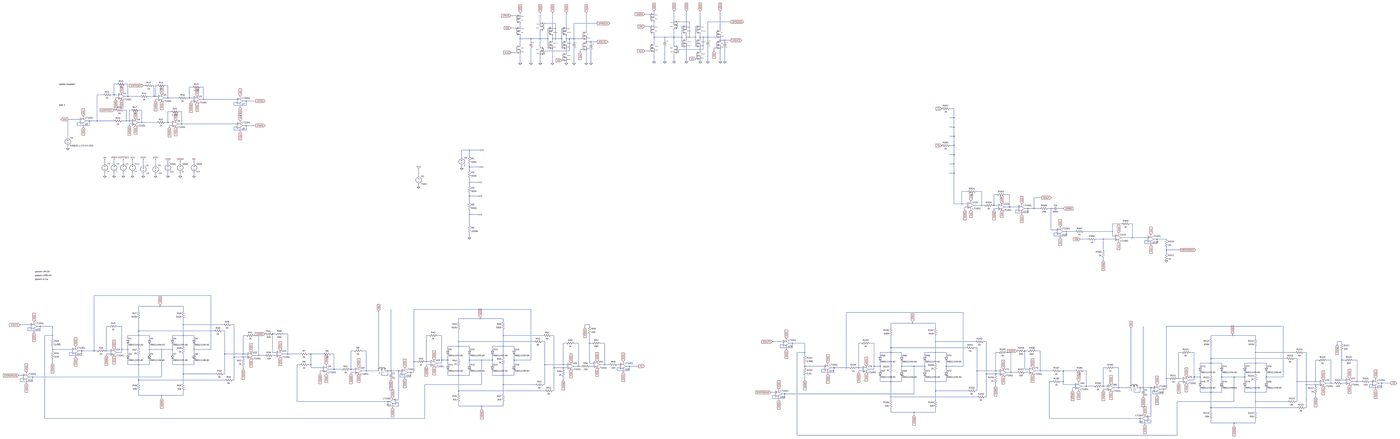
[diagram p0: schematic OZ_2_pure_curves.asc, whole sheet]
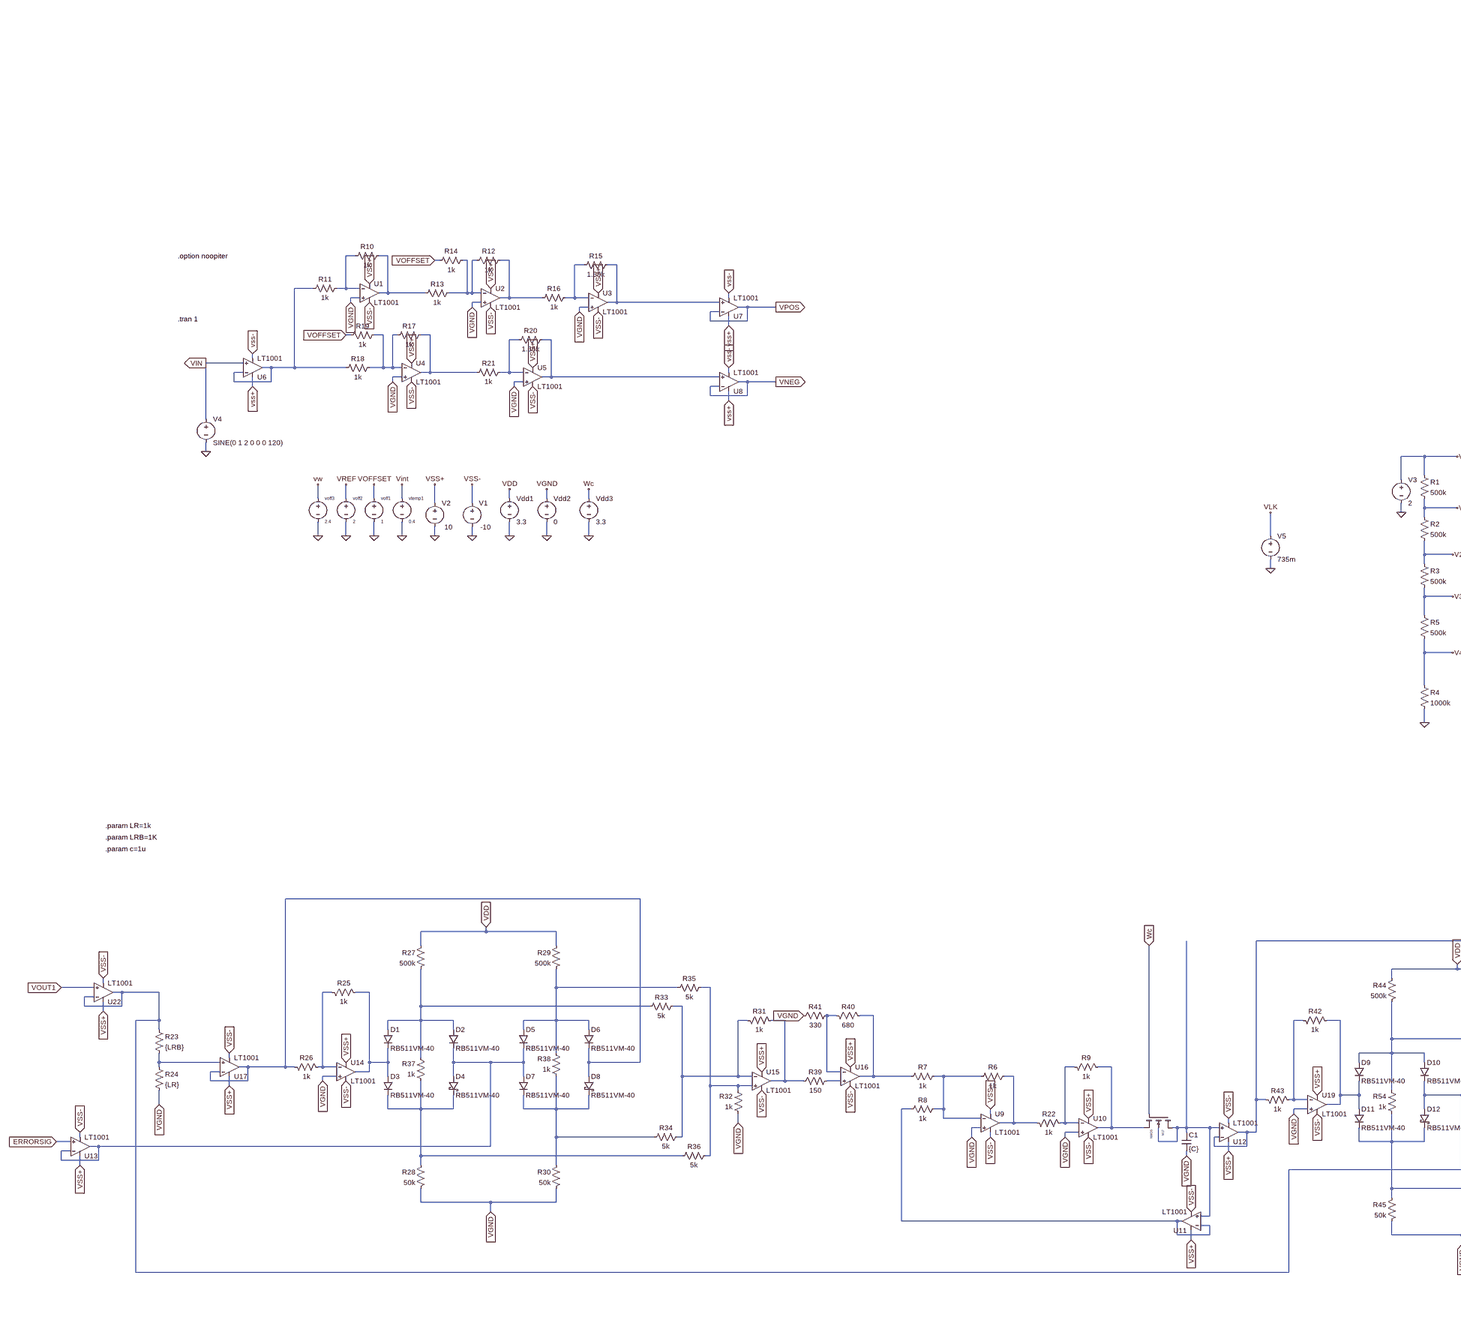
[diagram p1: schematic OZ_2_pure_curves.asc, part, row 1 of 1, column 1 of 3]
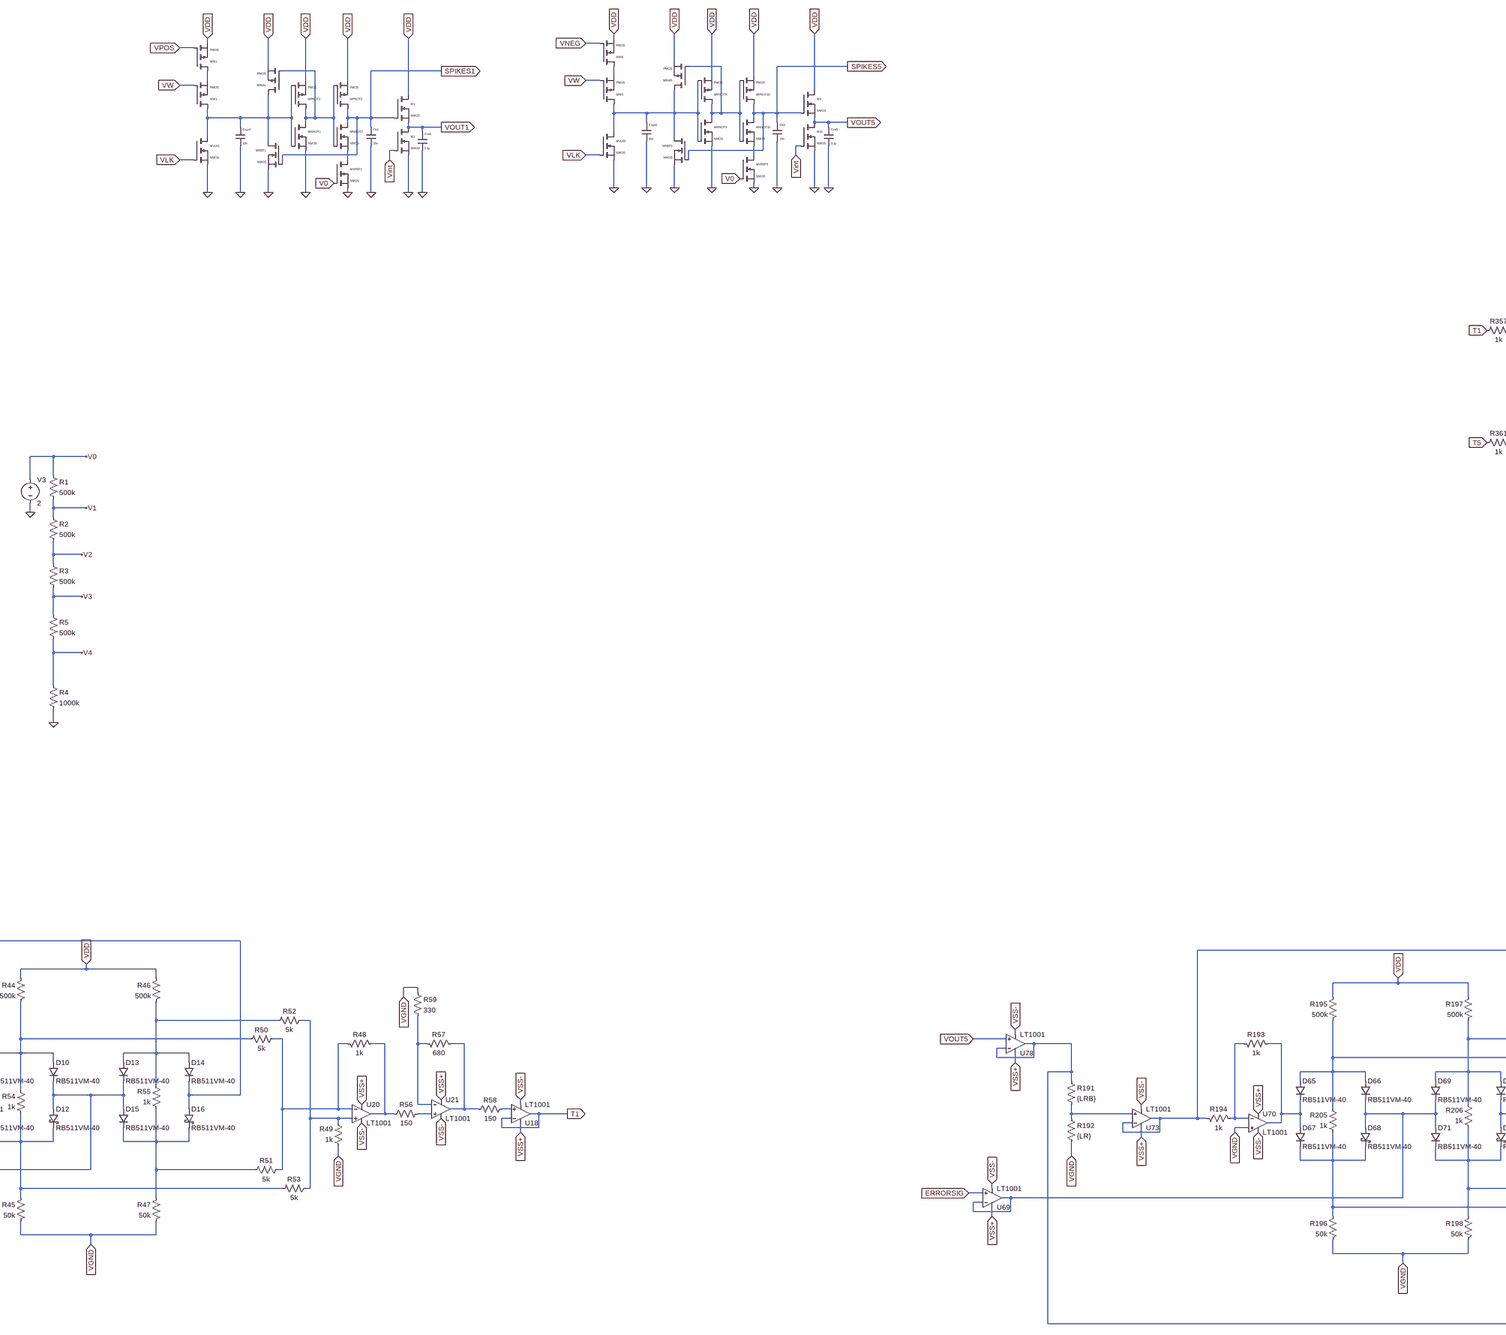
[diagram p2: schematic OZ_2_pure_curves.asc, part, row 1 of 1, column 2 of 3]
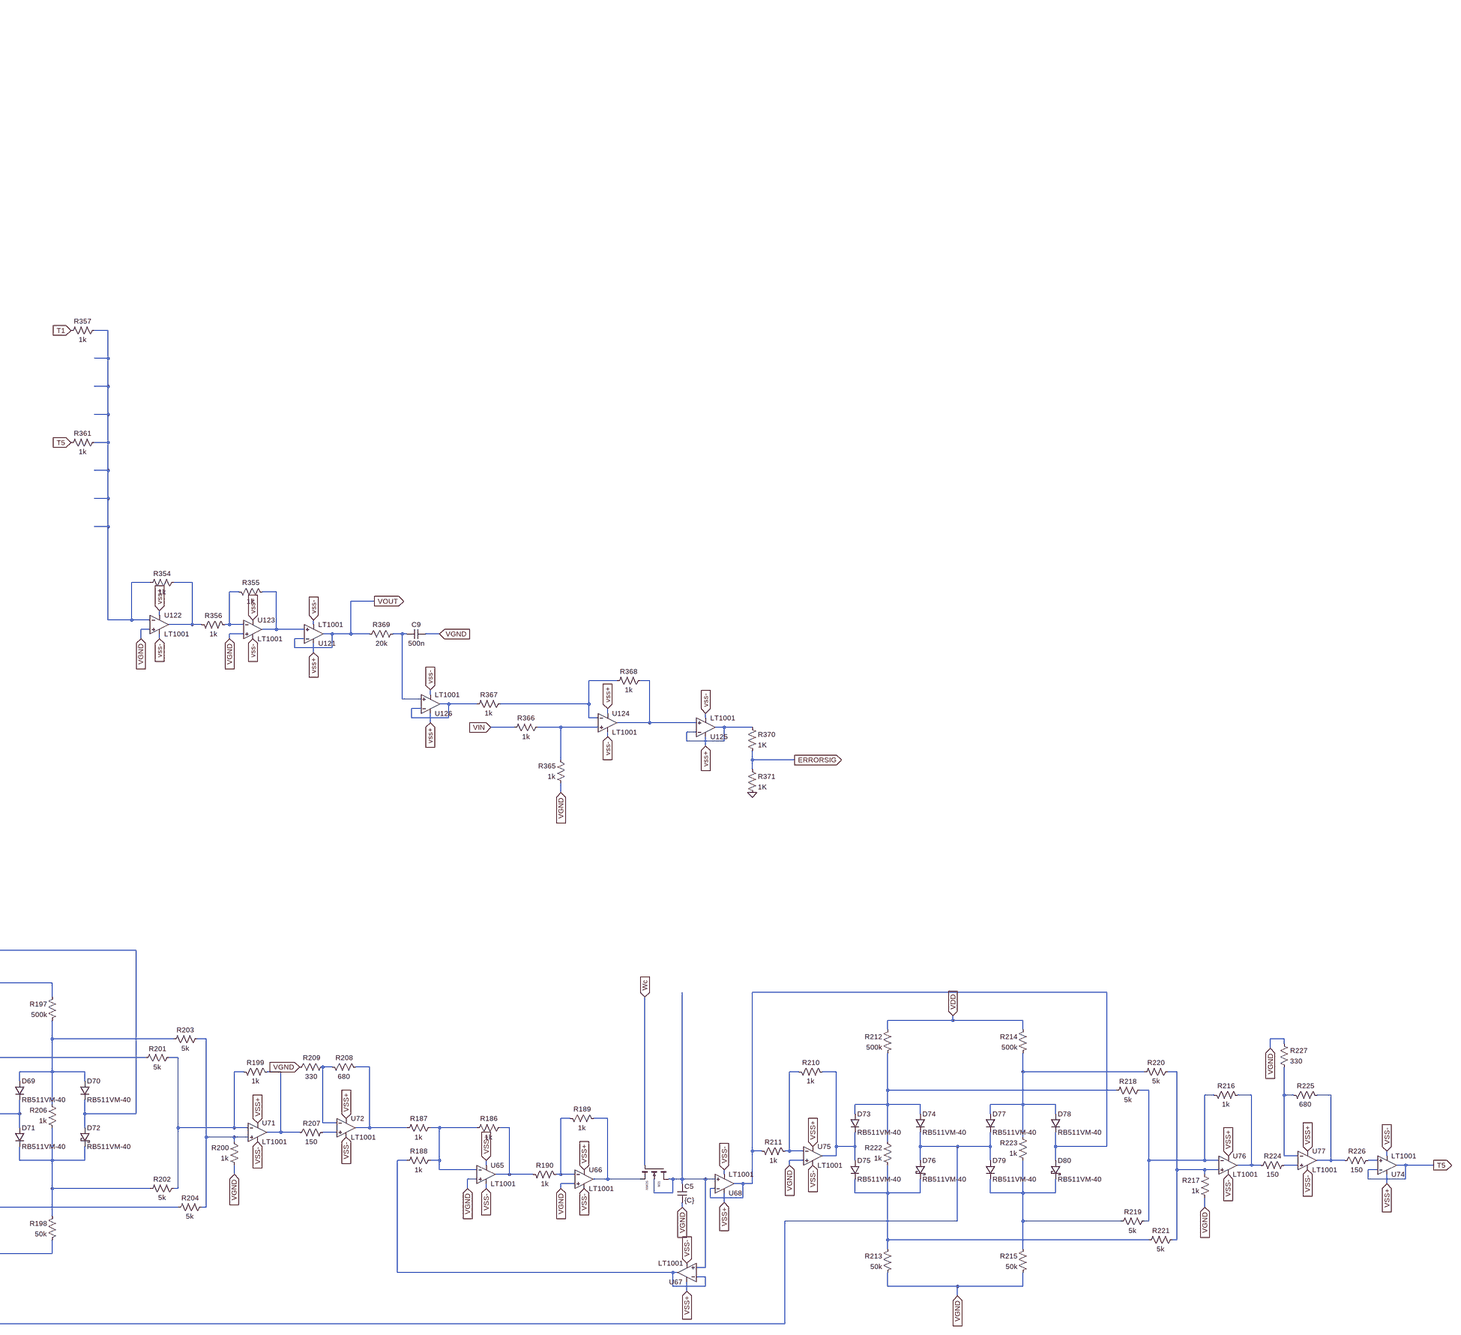
[diagram p3: schematic OZ_2_pure_curves.asc, part, row 1 of 1, column 3 of 3]
* OZ_2_pure_curves.asc
vtemp1 Vint 0 0.4
Vdd1 VDD 0 3.3
V1 VSS- 0 -10
V2 VSS+ 0 10
voff1 VOFFSET 0 1
voff2 VREF 0 2
voff3 vw 0 2.4
Vdd2 VGND 0 0
XU1 VGND N009 VSS+ VSS- N010 LT1001  ; pins In+ In- V+ V- OUT
R10 N010 N009 1k
R11 N009 N015 1k
XU2 VGND N011 VSS+ VSS- N012 LT1001  ; pins In+ In- V+ V- OUT
R12 N012 N011 1k
R13 N011 N010 1k
R14 N011 VOFFSET 1k
XU3 VGND N013 VSS+ VSS- N014 LT1001  ; pins In+ In- V+ V- OUT
R15 N014 N013 1.65k
R16 N013 N012 1k
XU4 VGND N017 VSS+ VSS- N018 LT1001  ; pins In+ In- V+ V- OUT
R17 N018 N017 1k
R18 N017 N015 1k
R19 N017 VOFFSET 1k
XU5 VGND N019 VSS+ VSS- N020 LT1001  ; pins In+ In- V+ V- OUT
R20 N020 N019 1.65k
R21 N019 N018 1k
XU6 VIN N015 VSS+ VSS- N015 LT1001  ; pins In+ In- V+ V- OUT
XU7 N014 VPOS VSS+ VSS- VPOS LT1001  ; pins In+ In- V+ V- OUT
XU8 N020 VNEG VSS+ VSS- VNEG LT1001  ; pins In+ In- V+ V- OUT
V4 VIN 0 SINE(0 1 2 0 0 0 120)
XU121 N023 VOUT VSS+ VSS- VOUT LT1001  ; pins In+ In- V+ V- OUT
XU122 VGND N016 VSS+ VSS- N021 LT1001  ; pins In+ In- V+ V- OUT
R354 N021 N016 1k
XU123 VGND N022 VSS+ VSS- N023 LT1001  ; pins In+ In- V+ V- OUT
R355 N022 N023 1k
R356 N021 N022 1k
R357 N016 T1 1k
R361 N016 T5 1k
M17 N088 Wc N063 N088 NMOS
C1 N088 VGND {C} IC=0
XU9 VGND N071 VSS+ VSS- N072 LT1001  ; pins In+ In- V+ V- OUT
R6 N072 N071 1k
R7 N071 N042 1k
R8 N071 N081 1k
XU10 VGND N062 VSS+ VSS- N063 LT1001  ; pins In+ In- V+ V- OUT
R9 N062 N063 1k
R22 N072 N062 1k
XU11 N088 N081 VSS+ VSS- N081 LT1001  ; pins In+ In- V+ V- OUT
XU12 N088 N031 VSS+ VSS- N031 LT1001  ; pins In+ In- V+ V- OUT
R23 N035 N060 {LRB}
R24 N060 VGND {LR}
XU13 ERRORSIG N061 VSS+ VSS- N061 LT1001  ; pins In+ In- V+ V- OUT
D1 N039 N037 RB511VM-40
XU14 VGND N036 VSS+ VSS- N037 LT1001  ; pins In+ In- V+ V- OUT
R25 N036 N037 1k
R26 N030 N036 1k
D2 N039 N061 RB511VM-40
D3 N037 N079 RB511VM-40
D4 N061 N079 RB511VM-40
R27 VDD N039 500k
R28 N079 VGND 50k
D5 N033 N061 RB511VM-40
D6 N033 N030 RB511VM-40
D7 N061 N080 RB511VM-40
D8 N030 N080 RB511VM-40
R29 VDD N033 500k
R30 N080 VGND 50k
XU15 N034 N040 VSS+ VSS- N043 LT1001  ; pins In+ In- V+ V- OUT
R31 N040 N043 1k
R32 VGND N034 1k
R33 N040 N039 5k
R34 N040 N080 5k
R35 N034 N033 5k
R36 N034 N079 5k
R37 N079 N039 1k
R38 N080 N033 1k
R39 N043 N073 150
XU16 N073 N041 VSS+ VSS- N042 LT1001  ; pins In+ In- V+ V- OUT
R40 N041 N042 680
R41 VGND N041 330
XU17 N060 N030 VSS+ VSS- N030 LT1001  ; pins In+ In- V+ V- OUT
XU18 N082 T1 VSS+ VSS- T1 LT1001  ; pins In+ In- V+ V- OUT
D9 N048 N045 RB511VM-40
XU19 VGND N044 VSS+ VSS- N045 LT1001  ; pins In+ In- V+ V- OUT
R42 N044 N045 1k
R43 N031 N044 1k
D10 N048 N035 RB511VM-40
D11 N045 N092 RB511VM-40
D12 N035 N092 RB511VM-40
R44 VDD N048 500k
R45 N092 VGND 50k
D13 N046 N035 RB511VM-40
D14 N046 N031 RB511VM-40
D15 N035 N093 RB511VM-40
D16 N031 N093 RB511VM-40
R46 VDD N046 500k
R47 N093 VGND 50k
XU20 N047 N049 VSS+ VSS- N052 LT1001  ; pins In+ In- V+ V- OUT
R48 N049 N052 1k
R49 VGND N047 1k
R50 N049 N048 5k
R51 N049 N093 5k
R52 N047 N046 5k
R53 N047 N092 5k
R54 N092 N048 1k
R55 N093 N046 1k
R56 N052 N083 150
XU21 N083 N053 VSS+ VSS- N054 LT1001  ; pins In+ In- V+ V- OUT
R57 N053 N054 680
R58 N054 N082 150
R59 VGND N053 330
XU22 VOUT1 N035 VSS+ VSS- N035 LT1001  ; pins In+ In- V+ V- OUT
M21 N099 Wc N087 N099 NMOS
C5 N099 VGND {C} IC=0
XU65 VGND N089 VSS+ VSS- N090 LT1001  ; pins In+ In- V+ V- OUT
R186 N090 N089 1k
R187 N089 N065 1k
R188 N089 N096 1k
XU66 VGND N086 VSS+ VSS- N087 LT1001  ; pins In+ In- V+ V- OUT
R189 N086 N087 1k
R190 N090 N086 1k
XU67 N099 N096 VSS+ VSS- N096 LT1001  ; pins In+ In- V+ V- OUT
XU68 N099 N038 VSS+ VSS- N038 LT1001  ; pins In+ In- V+ V- OUT
R191 N055 N084 {LRB}
R192 N084 VGND {LR}
XU69 ERRORSIG N085 VSS+ VSS- N085 LT1001  ; pins In+ In- V+ V- OUT
D65 N058 N057 RB511VM-40
XU70 VGND N056 VSS+ VSS- N057 LT1001  ; pins In+ In- V+ V- OUT
R193 N056 N057 1k
R194 N032 N056 1k
D66 N058 N085 RB511VM-40
D67 N057 N094 RB511VM-40
D68 N085 N094 RB511VM-40
R195 VDD N058 500k
R196 N094 VGND 50k
D69 N050 N085 RB511VM-40
D70 N050 N032 RB511VM-40
D71 N085 N095 RB511VM-40
D72 N032 N095 RB511VM-40
R197 VDD N050 500k
R198 N095 VGND 50k
XU71 N051 N059 VSS+ VSS- N066 LT1001  ; pins In+ In- V+ V- OUT
R199 N059 N066 1k
R200 VGND N051 1k
R201 N059 N058 5k
R202 N059 N095 5k
R203 N051 N050 5k
R204 N051 N094 5k
R205 N094 N058 1k
R206 N095 N050 1k
R207 N066 N091 150
XU72 N091 N064 VSS+ VSS- N065 LT1001  ; pins In+ In- V+ V- OUT
R208 N064 N065 680
R209 VGND N064 330
XU73 N084 N032 VSS+ VSS- N032 LT1001  ; pins In+ In- V+ V- OUT
XU74 N097 T5 VSS+ VSS- T5 LT1001  ; pins In+ In- V+ V- OUT
D73 N074 N068 RB511VM-40
XU75 VGND N067 VSS+ VSS- N068 LT1001  ; pins In+ In- V+ V- OUT
R210 N067 N068 1k
R211 N038 N067 1k
D74 N074 N055 RB511VM-40
D75 N068 N100 RB511VM-40
D76 N055 N100 RB511VM-40
R212 VDD N074 500k
R213 N100 VGND 50k
D77 N069 N055 RB511VM-40
D78 N069 N038 RB511VM-40
D79 N055 N101 RB511VM-40
D80 N038 N101 RB511VM-40
R214 VDD N069 500k
R215 N101 VGND 50k
XU76 N070 N075 VSS+ VSS- N076 LT1001  ; pins In+ In- V+ V- OUT
R216 N075 N076 1k
R217 VGND N070 1k
R218 N075 N074 5k
R219 N075 N101 5k
R220 N070 N069 5k
R221 N070 N100 5k
R222 N100 N074 1k
R223 N101 N069 1k
R224 N076 N098 150
XU77 N098 N077 VSS+ VSS- N078 LT1001  ; pins In+ In- V+ V- OUT
R225 N077 N078 680
R226 N078 N097 150
R227 VGND N077 330
XU78 VOUT5 N055 VSS+ VSS- N055 LT1001  ; pins In+ In- V+ V- OUT
XU124 N028 N025 VSS+ VSS- N026 LT1001  ; pins In+ In- V+ V- OUT
R365 VGND N028 1k
R366 N028 VIN 1k
R367 N025 N027 1k
R368 N026 N025 1k
XU125 N026 N029 VSS+ VSS- N029 LT1001  ; pins In+ In- V+ V- OUT
R369 VOUT N024 20k
C9 N024 VGND 500n
XU126 N024 N027 VSS+ VSS- N027 LT1001  ; pins In+ In- V+ V- OUT
R370 N029 ERRORSIG 1K
R371 ERRORSIG 0 1K
Vdd3 Wc 0 3.3
MW1 N006 vw N004 N004 PMOS
Csyn1 N006 0 10n V=4 Irms=162m Rser=0.395426 Lser=0 mfg="KEMET" pn="C0402C103K7PAC" type="X5R" IC=0
Ck1 SPIKES1 0 10n
MPNOT1 N002 N006 VDD VDD PMOS
MNNOT1 N002 N006 0 0 NMOS
MVREF1 N008 V0 0 0 NMOS
MREF1 N006 SPIKES1 0 0 NMOS
MVLK1 N006 VLK 0 0 NMOS
MINA1 N006 N002 VDD VDD PMOS
MIN1 N004 VPOS VDD VDD PMOS
MPNOT2 SPIKES1 N002 VDD VDD PMOS
MNNOT2 SPIKES1 N002 N008 N008 NMOS
M1 VDD SPIKES1 VOUT1 VOUT1 NMOS
M2 VOUT1 Vint 0 0 NMOS
Cint1 VOUT1 0 0.1µ
MW5 N005 vw N003 N003 PMOS
Csyn5 N005 0 10n V=4 Irms=162m Rser=0.395426 Lser=0 mfg="KEMET" pn="C0402C103K7PAC" type="X5R" IC=0
Ck5 SPIKES5 0 10n
MPNOT9 N001 N005 VDD VDD PMOS
MNNOT9 N001 N005 0 0 NMOS
MVREF5 N007 V0 0 0 NMOS
MREF5 N005 SPIKES5 0 0 NMOS
MVLK5 N005 VLK 0 0 NMOS
MINA5 N005 N001 VDD VDD PMOS
MIN5 N003 VNEG VDD VDD PMOS
MPNOT10 SPIKES5 N001 VDD VDD PMOS
MNNOT10 SPIKES5 N001 N007 N007 NMOS
M9 VDD SPIKES5 VOUT5 VOUT5 NMOS
M10 VOUT5 Vint 0 0 NMOS
Cint5 VOUT5 0 0.1µ
V3 V0 0 2
R1 V0 V1 500k
R2 V1 V2 500k
R3 V2 V3 500k
R4 V4 0 1000k
R5 V3 V4 500k
V5 VLK 0 735m
.model D D
.lib standard.dio
.model NMOS NMOS
.model PMOS PMOS
.lib standard.mos
.tran 1
.option noopiter
.param LR=1k
.param LRB=1K
.param c=1u
.lib LTC.lib
.backanno
.end